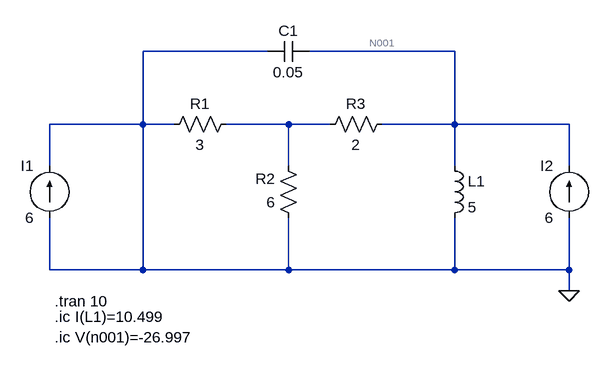
[diagram p0: schematic Task1.asc]
Task1.asc, the LTspice schematic file:
Version 4
SHEET 1 880 680
WIRE 288 -32 96 -32
WIRE 576 -32 352 -32
WIRE 96 80 96 -32
WIRE 96 80 -48 80
WIRE 144 80 96 80
WIRE 320 80 224 80
WIRE 384 80 320 80
WIRE 576 80 576 -32
WIRE 576 80 464 80
WIRE 752 80 576 80
WIRE -48 144 -48 80
WIRE 320 144 320 80
WIRE 576 144 576 80
WIRE 752 144 752 80
WIRE -48 304 -48 224
WIRE 96 304 96 80
WIRE 96 304 -48 304
WIRE 320 304 320 224
WIRE 320 304 96 304
WIRE 576 304 576 224
WIRE 576 304 320 304
WIRE 752 304 752 224
WIRE 752 304 576 304
WIRE 752 336 752 304
FLAG 752 336 0
SYMBOL current -48 224 R180
WINDOW 0 24 80 Left 2
WINDOW 3 24 0 Left 2
WINDOW 123 0 0 Left 0
WINDOW 39 0 0 Left 0
SYMATTR InstName I1
SYMATTR Value 6
SYMBOL res 240 64 R90
WINDOW 0 0 56 VBottom 2
WINDOW 3 32 56 VTop 2
SYMATTR InstName R1
SYMATTR Value 3
SYMBOL res 336 240 R180
WINDOW 0 36 76 Left 2
WINDOW 3 36 40 Left 2
SYMATTR InstName R2
SYMATTR Value 6
SYMBOL res 368 96 R270
WINDOW 0 32 56 VTop 2
WINDOW 3 0 56 VBottom 2
SYMATTR InstName R3
SYMATTR Value 2
SYMBOL cap 288 -16 R270
WINDOW 0 32 32 VTop 2
WINDOW 3 0 32 VBottom 2
SYMATTR InstName C1
SYMATTR Value 0.05
SYMBOL ind 560 128 R0
SYMATTR InstName L1
SYMATTR Value 5
SYMBOL current 752 224 R180
WINDOW 0 24 80 Left 2
WINDOW 3 24 0 Left 2
WINDOW 123 0 0 Left 0
WINDOW 39 0 0 Left 0
SYMATTR InstName I2
SYMATTR Value 6
TEXT -40 352 Left 2 !.tran 10
TEXT -40 376 Left 2 !.ic I(L1)=10.499
TEXT -40 408 Left 2 !.ic V(n001)=-26.997

The netlist it stands for:
* Task1.asc
I1 0 0 6
R1 N002 0 3
R2 0 N002 6
R3 N002 N001 2
C1 0 N001 0.05
L1 N001 0 5
I2 0 N001 6
.tran 10
.ic I(L1)=10.499
.ic V(n001)=-26.997
.backanno
.end